# Altium schematic sheet 00 - Structure.SchDoc
size A4; DocumentNumber: 1; SheetNumber: 1; SheetTotal: 4
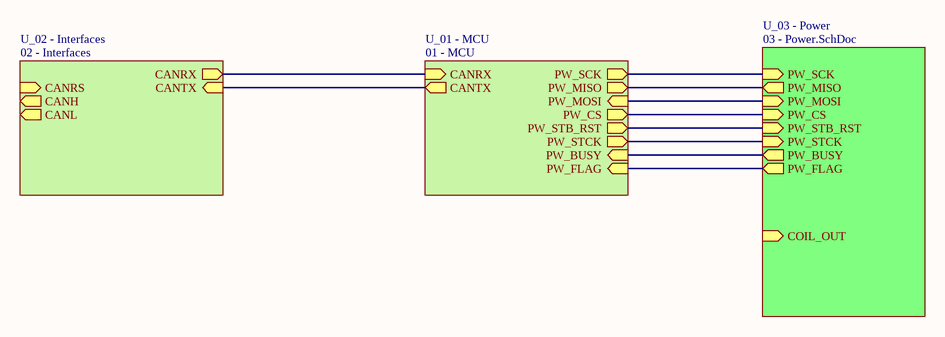
[diagram p0: 00 - Structure.SchDoc]

## Sub-sheets
U_01 - MCU = 01 - MCU: CANTX (out), CANRX (in), PW_SCK (out), PW_MISO (out), PW_MOSI (in), PW_CS (out), PW_STB_RST (out), PW_STCK (out), PW_FLAG (in), PW_BUSY (in)
U_02 - Interfaces = 02 - Interfaces: CANH (out), CANL (out), CANTX (in), CANRX (out), CANRS (in)
U_03 - Power = 03 - Power.SchDoc: COIL_OUT (in), PW_CS (in), PW_SCK (in), PW_MISO (out), PW_MOSI (in), PW_STB_RST (in), PW_BUSY (out), PW_FLAG (out), PW_STCK (in)

## Nets
(unnamed): sheet U_03 - Power/PW_CS, sheet U_01 - MCU/PW_CS
(unnamed): sheet U_03 - Power/PW_SCK, sheet U_01 - MCU/PW_SCK
(unnamed): sheet U_03 - Power/PW_MISO, sheet U_01 - MCU/PW_MISO
(unnamed): sheet U_03 - Power/PW_MOSI, sheet U_01 - MCU/PW_MOSI
(unnamed): sheet U_03 - Power/PW_STB_RST, sheet U_01 - MCU/PW_STB_RST
(unnamed): sheet U_03 - Power/PW_BUSY, sheet U_01 - MCU/PW_BUSY
(unnamed): sheet U_03 - Power/PW_FLAG, sheet U_01 - MCU/PW_FLAG
(unnamed): sheet U_03 - Power/PW_STCK, sheet U_01 - MCU/PW_STCK
(unnamed): sheet U_01 - MCU/CANTX, sheet U_02 - Interfaces/CANTX
(unnamed): sheet U_01 - MCU/CANRX, sheet U_02 - Interfaces/CANRX